# Altium schematic sheet aKaReZa75_eBoard_STM32F103C8__STM32F103C8__Main.SchDoc: Main
size A4; SheetNumber: 1; SheetTotal: 4
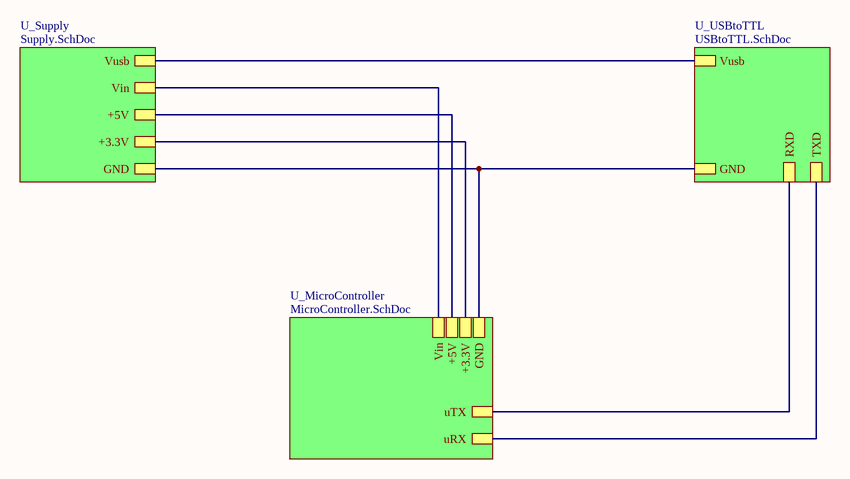
[diagram p0: aKaReZa75_eBoard_STM32F103C8__STM32F103C8__Main.SchDoc]

## Sub-sheets
U_MicroController = MicroController.SchDoc: +3.3V, GND, +5V, Vin, uRX, uTX
U_Supply = Supply.SchDoc: +3.3V, GND, Vusb, +5V, Vin
U_USBtoTTL = USBtoTTL.SchDoc: TXD, RXD, Vusb, GND

## Nets
(unnamed): sheet U_Supply/+3.3V, sheet U_MicroController/+3.3V
(unnamed): sheet U_Supply/GND, sheet U_USBtoTTL/GND, sheet U_MicroController/GND
(unnamed): sheet U_Supply/Vusb, sheet U_USBtoTTL/Vusb
(unnamed): sheet U_Supply/+5V, sheet U_MicroController/+5V
(unnamed): sheet U_Supply/Vin, sheet U_MicroController/Vin
(unnamed): sheet U_USBtoTTL/TXD, sheet U_MicroController/uRX
(unnamed): sheet U_USBtoTTL/RXD, sheet U_MicroController/uTX

## Notes on the sheet
- Title:
- Project:
- Drawn by:
- Revision:
- Hossein Bagheri
- Company:
- Sheet
- of